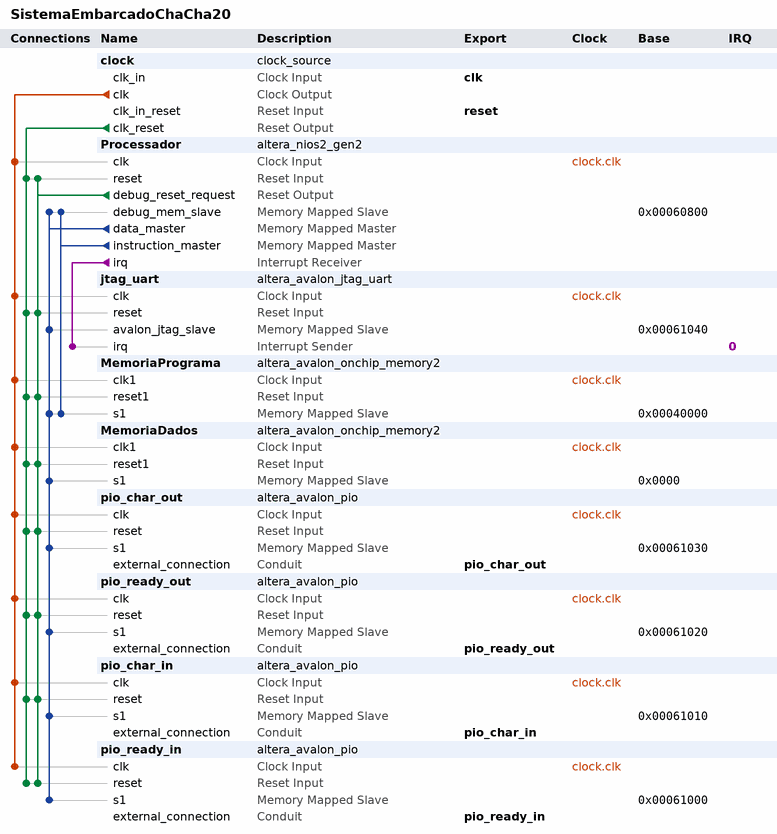
[diagram p0: system contents]
# Platform Designer (Qsys) system SistemaEmbarcadoChaCha20, Cyclone IV E EP4CE115F29C7
# Parameters at their usual value, and those the tool derives, are not listed.
package require -exact qsys 18.1
create_system SistemaEmbarcadoChaCha20
set_project_property DEVICE_FAMILY {Cyclone IV E}
set_project_property DEVICE EP4CE115F29C7

add_instance clock clock_source 18.1
set_instance_parameter_value clock clockFrequency 50000000

add_instance Processador altera_nios2_gen2 18.1
set_instance_parameter_value Processador dcache_size 2048
set_instance_parameter_value Processador exceptionSlave MemoriaPrograma.s1
set_instance_parameter_value Processador icache_size 4096
set_instance_parameter_value Processador impl Tiny
set_instance_parameter_value Processador resetSlave MemoriaPrograma.s1

add_instance jtag_uart altera_avalon_jtag_uart 18.1
set_instance_parameter_value jtag_uart simInteractiveOptions NO_INTERACTIVE_WINDOWS

add_instance MemoriaPrograma altera_avalon_onchip_memory2 18.1
set_instance_parameter_value MemoriaPrograma dataWidth 32
set_instance_parameter_value MemoriaPrograma dualPort false
set_instance_parameter_value MemoriaPrograma initMemContent true
set_instance_parameter_value MemoriaPrograma initializationFileName onchip_mem.hex
set_instance_parameter_value MemoriaPrograma instanceID RAM
set_instance_parameter_value MemoriaPrograma memorySize 131072

add_instance MemoriaDados altera_avalon_onchip_memory2 18.1
set_instance_parameter_value MemoriaDados allowInSystemMemoryContentEditor true
set_instance_parameter_value MemoriaDados dataWidth 32
set_instance_parameter_value MemoriaDados dualPort false
set_instance_parameter_value MemoriaDados initMemContent true
set_instance_parameter_value MemoriaDados initializationFileName F:/Documentos/UFBA/Lab_Integrado_IV/Projeto_Chacha20/Chacha20/ChaCha20_Quartus/ChaCha20/ChaCha20/MemoriaDados_90kb.mif
set_instance_parameter_value MemoriaDados instanceID ROM
set_instance_parameter_value MemoriaDados memorySize 131072
set_instance_parameter_value MemoriaDados useNonDefaultInitFile true
set_instance_parameter_value MemoriaDados writable false

add_instance pio_char_out altera_avalon_pio 18.1
set_instance_parameter_value pio_char_out direction Output
set_instance_parameter_value pio_char_out width 8

add_instance pio_ready_out altera_avalon_pio 18.1
set_instance_parameter_value pio_ready_out direction Output
set_instance_parameter_value pio_ready_out width 2

add_instance pio_char_in altera_avalon_pio 18.1
set_instance_parameter_value pio_char_in direction Input
set_instance_parameter_value pio_char_in width 8

add_instance pio_ready_in altera_avalon_pio 18.1
set_instance_parameter_value pio_ready_in direction Input
set_instance_parameter_value pio_ready_in width 2

# connections
add_connection clock.clk jtag_uart.clk clock
add_connection clock.clk MemoriaDados.clk1 clock
add_connection clock.clk MemoriaPrograma.clk1 clock
add_connection clock.clk pio_char_in.clk clock
add_connection clock.clk pio_char_out.clk clock
add_connection clock.clk pio_ready_in.clk clock
add_connection clock.clk pio_ready_out.clk clock
add_connection clock.clk Processador.clk clock
add_connection clock.clk_reset jtag_uart.reset reset
add_connection clock.clk_reset MemoriaDados.reset1 reset
add_connection clock.clk_reset MemoriaPrograma.reset1 reset
add_connection clock.clk_reset pio_char_in.reset reset
add_connection clock.clk_reset pio_char_out.reset reset
add_connection clock.clk_reset pio_ready_in.reset reset
add_connection clock.clk_reset pio_ready_out.reset reset
add_connection clock.clk_reset Processador.reset reset
add_connection Processador.debug_reset_request jtag_uart.reset reset
add_connection Processador.debug_reset_request MemoriaDados.reset1 reset
add_connection Processador.debug_reset_request MemoriaPrograma.reset1 reset
add_connection Processador.debug_reset_request pio_char_in.reset reset
add_connection Processador.debug_reset_request pio_char_out.reset reset
add_connection Processador.debug_reset_request pio_ready_in.reset reset
add_connection Processador.debug_reset_request pio_ready_out.reset reset
add_connection Processador.debug_reset_request Processador.reset reset
add_connection Processador.data_master jtag_uart.avalon_jtag_slave avalon
set_connection_parameter_value Processador.data_master/jtag_uart.avalon_jtag_slave baseAddress 0x00061040
add_connection Processador.data_master MemoriaDados.s1 avalon
set_connection_parameter_value Processador.data_master/MemoriaDados.s1 baseAddress 0x0000
add_connection Processador.data_master MemoriaPrograma.s1 avalon
set_connection_parameter_value Processador.data_master/MemoriaPrograma.s1 baseAddress 0x00040000
add_connection Processador.data_master pio_char_in.s1 avalon
set_connection_parameter_value Processador.data_master/pio_char_in.s1 baseAddress 0x00061010
add_connection Processador.data_master pio_char_out.s1 avalon
set_connection_parameter_value Processador.data_master/pio_char_out.s1 baseAddress 0x00061030
add_connection Processador.data_master pio_ready_in.s1 avalon
set_connection_parameter_value Processador.data_master/pio_ready_in.s1 baseAddress 0x00061000
add_connection Processador.data_master pio_ready_out.s1 avalon
set_connection_parameter_value Processador.data_master/pio_ready_out.s1 baseAddress 0x00061020
add_connection Processador.data_master Processador.debug_mem_slave avalon
set_connection_parameter_value Processador.data_master/Processador.debug_mem_slave baseAddress 0x00060800
add_connection Processador.instruction_master MemoriaPrograma.s1 avalon
set_connection_parameter_value Processador.instruction_master/MemoriaPrograma.s1 baseAddress 0x00040000
add_connection Processador.instruction_master Processador.debug_mem_slave avalon
set_connection_parameter_value Processador.instruction_master/Processador.debug_mem_slave baseAddress 0x00060800
add_connection Processador.irq jtag_uart.irq interrupt
set_connection_parameter_value Processador.irq/jtag_uart.irq irqNumber 0

# exported interfaces
add_interface clk clock sink
set_interface_property clk EXPORT_OF clock.clk_in
add_interface pio_char_in conduit end
set_interface_property pio_char_in EXPORT_OF pio_char_in.external_connection
add_interface pio_char_out conduit end
set_interface_property pio_char_out EXPORT_OF pio_char_out.external_connection
add_interface pio_ready_in conduit end
set_interface_property pio_ready_in EXPORT_OF pio_ready_in.external_connection
add_interface pio_ready_out conduit end
set_interface_property pio_ready_out EXPORT_OF pio_ready_out.external_connection
add_interface reset reset sink
set_interface_property reset EXPORT_OF clock.clk_in_reset

set_interconnect_requirement {$system} qsys_mm.clockCrossingAdapter HANDSHAKE
set_interconnect_requirement {$system} qsys_mm.enableEccProtection FALSE
set_interconnect_requirement {$system} qsys_mm.insertDefaultSlave FALSE
set_interconnect_requirement {$system} qsys_mm.maxAdditionalLatency 1

save_system SistemaEmbarcadoChaCha20.qsys
